# Altium project Group_2.PrjPcb
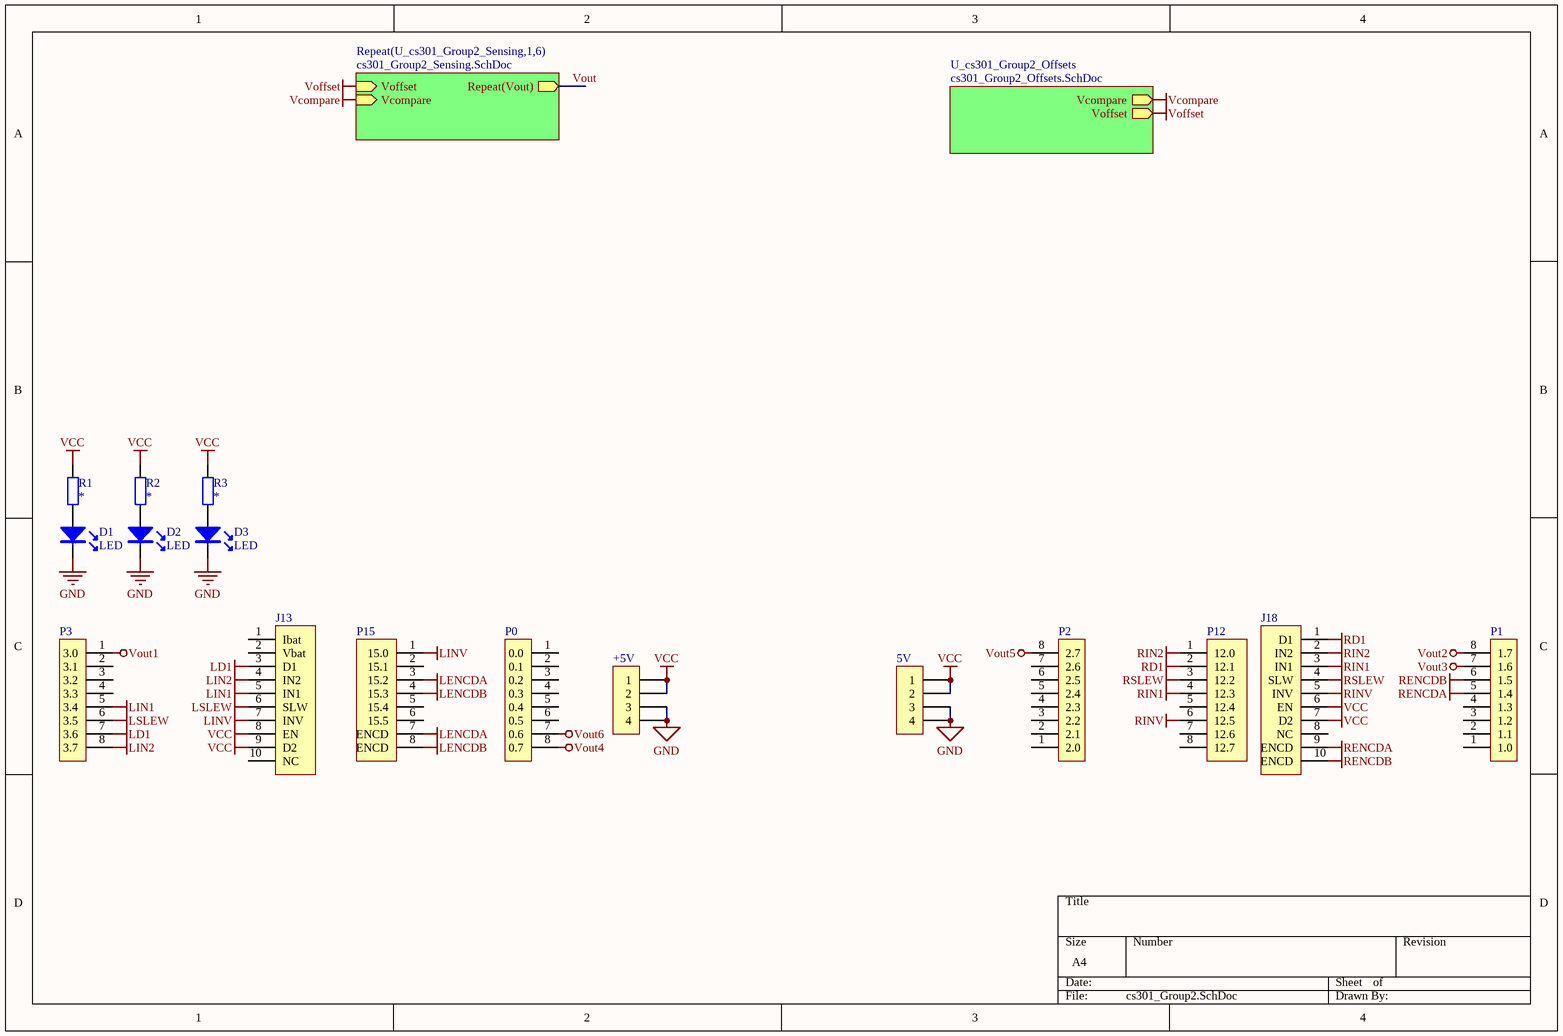
[diagram p0: cs301_Group2.SchDoc]
3 sheets, 164 parts. Net scope: hierarchical (ports join the sheet entries above them; power ports are global).
Board file: cs301_Group2_PCB.PcbDoc
Sheets:
  cs301_Group2.SchDoc
    U_cs301_Group2_Sensing1 = cs301_Group2_Sensing.SchDoc
    U_cs301_Group2_Sensing2 = cs301_Group2_Sensing.SchDoc
    U_cs301_Group2_Sensing3 = cs301_Group2_Sensing.SchDoc
    U_cs301_Group2_Sensing4 = cs301_Group2_Sensing.SchDoc
    U_cs301_Group2_Sensing5 = cs301_Group2_Sensing.SchDoc
    U_cs301_Group2_Sensing6 = cs301_Group2_Sensing.SchDoc
    U_cs301_Group2_Offsets = cs301_Group2_Offsets.SchDoc

## Sheet cs301_Group2.SchDoc
size A4; SheetNumber: 1; SheetTotal: 3

### Parts
5V  5V  [IDC4]  (value not drawn)
+5V  5V  [IDC4]  (value not drawn)
D1  LED  [LED0.1/5MM]
D2  LED  [LED0.1/5MM]
D3  LED  [LED0.1/5MM]
J13  CON10  [idc10]  (value not drawn)
J18  CON10  [IDC10]  (value not drawn)
P0  P0  [idc8]  (value not drawn)
P1  P1  [idc8]  (value not drawn)
P2  P2  [idc8]  (value not drawn)
P3  P3  [idc8]  (value not drawn)
P12  P12  [idc8]  (value not drawn)
P15  P15  [idc8]  (value not drawn)
R1  *  [0805 RES]
R2  *  [0805 RES]
R3  *  [0805 RES]

### Sub-sheets
Repeat(U_cs301_Group2_Sensing,1,6) = cs301_Group2_Sensing.SchDoc: Voffset (in), Vcompare (in), Repeat(Vout) (out)
U_cs301_Group2_Offsets = cs301_Group2_Offsets.SchDoc: Vcompare (out), Voffset (out)

### Nets
GND: 5V.3 5V.4 +5V.3 +5V.4 D1.K D2.K D3.K
LD1: J13.3(D1) P3.7(3.6)
LENCDA: P15.3(15.2) P15.7(ENCD)
LENCDB: P15.4(15.3) P15.8(ENCD)
LIN1: J13.5(IN1) P3.5(3.4)
LIN2: J13.4(IN2) P3.8(3.7)
LINV: J13.7(INV) P15.1(15.0)
LSLEW: J13.6(SLW) P3.6(3.5)
RD1: J18.1(D1) P12.2(12.1)
RENCDA: J18.9(ENCD) P1.5(1.4)
RENCDB: J18.10(ENCD) P1.6(1.5)
RIN1: J18.3(IN1) P12.4(12.3)
RIN2: J18.2(IN2) P12.1(12.0)
RINV: J18.5(INV) P12.6(12.5)
RSLEW: J18.4(SLW) P12.3(12.2)
VCC: 5V.1 5V.2 +5V.1 +5V.2 J13.8(EN) J13.9(D2) J18.6(EN) J18.7(D2) R1.2 R2.2 R3.2
Vcompare: sheet Repeat(U_cs301_Group2_Sensing,1,6)/Vcompare, sheet U_cs301_Group2_Offsets/Vcompare
Voffset: sheet Repeat(U_cs301_Group2_Sensing,1,6)/Voffset, sheet U_cs301_Group2_Offsets/Voffset
Vout1: P3.1(3.0)
Vout2: P1.8(1.7)
Vout3: P1.7(1.6)
Vout4: P0.8(0.7)
Vout5: P2.8(2.7)
Vout6: P0.7(0.6)
Vout: sheet Repeat(U_cs301_Group2_Sensing,1,6)/Repeat(Vout)
NetD1_A: D1.A R1.1
NetD2_A: D2.A R2.1
NetD3_A: D3.A R3.1

Not connected (* = marked no-connect by the designer): J13 1(Ibat) 2(Vbat) 10(NC); J18 8(NC); P0 1(0.0) 2(0.1) 3(0.2) 4(0.3) 5(0.4) 6(0.5); P1 1(1.0) 2(1.1) 3(1.2) 4(1.3); P2 1(2.0) 2(2.1) 3(2.2) 4(2.3) 5(2.4) 6(2.5) 7(2.6); P3 2(3.1) 3(3.2) 4(3.3); P12 5(12.4) 7(12.6) 8(12.7); P15 2(15.1) 5(15.4) 6(15.5)

### Library data of the parts
5V +5V = CON4: Connector
J13 J18 = CON10: Connector
P0-P3 = CON8: Connector
P12 P15 = CON8_1: Connector
R1-R3 = Res_SMT_0805: 0805 resistor; Published: 8-Jun-2000; LatestRevisionDate: 17-Jul-2002; LatestRevisionNote: Re-released for DXP Platform.; PackageReference: AXIAL-0.4; Publisher: Altium Limited; Value: *; ComponentLink1Description: https://nz.mouser.com/datasheet/2/315/AOA0000C304-1149620.pdf

## Sheet cs301_Group2_Sensing.SchDoc
size A4; SheetNumber: 2; SheetTotal: 3
Used 6 times, as channels U_cs301_Group2_Sensing1, U_cs301_Group2_Sensing2, U_cs301_Group2_Sensing3, U_cs301_Group2_Sensing4, U_cs301_Group2_Sensing5, U_cs301_Group2_Sensing6. Parts and nets are listed once, with the designators drawn on the sheet.
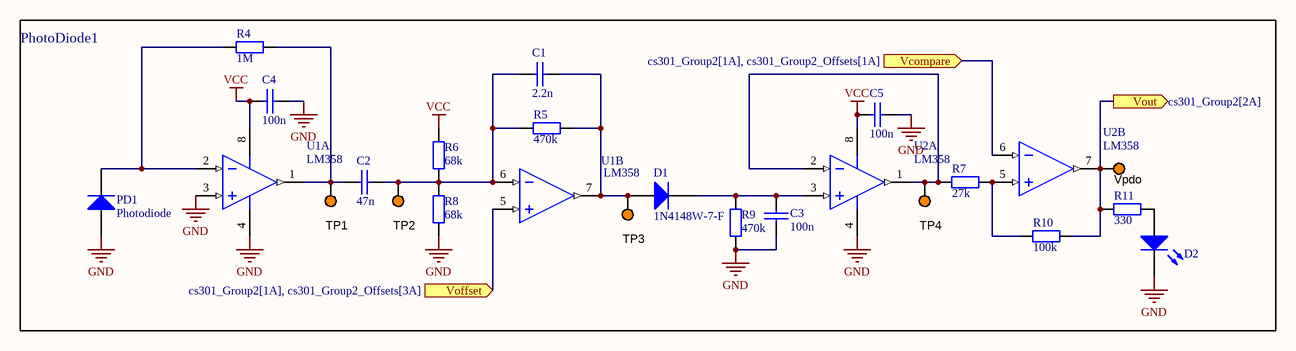
[diagram p1: cs301_Group2_Sensing.SchDoc]

### Parts
C1  2.2n  [0805 CAP]
C2  47n  [0805 CAP]
C3  100n  [0805 CAP]
C4  100n  [0805 CAP]
C5  100n  [0805 CAP]
D1  1N4148W-7-F  [SOD123]
D2  LTST-C170KGKT  [0805 LED]  (value not drawn)
PD1  Photodiode  [SOD123]
R4  1M  [0805 RES]
R5  470k  [0805 RES]
R6  68k  [0805 RES]
R7  27k  [0805 RES]
R8  68k  [0805 RES]
R9  470k  [0805 RES]
R10  100k  [0805 RES]
R11  330  [0805 RES]
TP1  5003  [TP_TH]  (value not drawn)
TP2  5003  [TP_TH]  (value not drawn)
TP3  5003  [TP_TH]  (value not drawn)
TP4  5003  [TP_TH]  (value not drawn)
U1  LM358  [SO - 8]  (parts A,B of 2)
U2  LM358  [SO - 8]  (parts A,B of 2)
Vpdo  5003  [TP_TH]  (value not drawn)

### Blocks framed on the sheet
PhotoDiode1: C1-C5 D1 D2 PD1 R4-R11 TP1-TP4 U1 U2 Vpdo

### Ports
Vcompare (in, see cs301_Group2[1A], cs301_Group2_Offsets[1A]), Voffset (in, see cs301_Group2[1A], cs301_Group2_Offsets[3A]), Vout (out, see cs301_Group2[2A])

### Nets
GND: C3.1 C4.2 C5.2 D2.2(K) PD1.1(A) R8.1 R9.1 U1.3(VINA+) U1.4(VSS) U2.4(VSS)
VCC: C4.1 C5.1 R6.2 U1.8(VDD) U2.8(VDD)
Vcompare: U2.6(VINA-) ; port Vcompare
Voffset: U1.5(VINA+) ; port Voffset
Vout: R10.1 R11.1 U2.7(VOUTA) Vpdo.1 ; port Vout
NetC1_1: C1.1 C2.2 R5.2 R6.1 R8.2 TP2.1 U1.6(VINA-)
NetC1_2: C1.2 D1.1(A) R5.1 TP3.1 U1.7(VOUTA)
NetC2_1: C2.1 R4.1 TP1.1 U1.1(VOUTA)
NetC3_2: C3.2 D1.2(K) R9.2 U2.3(VINA+)
NetD2_1: D2.1(A) R11.2
NetPD1_2: PD1.2(K) R4.2 U1.2(VINA-)
NetR7_1: R7.1 R10.2 U2.5(VINA+)
NetR7_2: R7.2 TP4.1 U2.1(VOUTA) U2.2(VINA-)

### Channels
U_cs301_Group2_Sensing1: designators end in A; ports Vcompare=Vcompare Voffset=Voffset Vout=Vout1
U_cs301_Group2_Sensing2: designators end in B; ports Vcompare=Vcompare Voffset=Voffset Vout=Vout2
U_cs301_Group2_Sensing3: designators end in C; ports Vcompare=Vcompare Voffset=Voffset Vout=Vout3
U_cs301_Group2_Sensing4: designators end in D; ports Vcompare=Vcompare Voffset=Voffset Vout=Vout4
U_cs301_Group2_Sensing5: designators end in E; ports Vcompare=Vcompare Voffset=Voffset Vout=Vout5
U_cs301_Group2_Sensing6: designators end in F; ports Vcompare=Vcompare Voffset=Voffset Vout=Vout6

### Library data of the parts
C1-C5 = CerCap_SMT_0805: SMT ceramic capacitor 0805 size; Value: *
D1 = ES1H_SMT_DO214: 1N4148 100V 200mA SOD-123 diode; Manufacturer: ON Semiconductor; Manufacturer Part Number: 1N4148TR; Diode Type: Standard; Speed: Small Signal =< 200mA (Io), Any Speed; Capacitance @ Vr, F: 4pF @ 0V, 1MHz; Supplier 1: Digi-Key; RoHS: RoHS Compliant; Category: Discrete Semiconductor Products; Stock 1: 1658049; Pricing 1: 1=0.16, 10=0.109, 100=0.0592, 500=0.03648, 1000=0.02488 (NZD); Part Status: Active; Current - Average Rectified (Io): 200mA; Mounting Type: Through Hole; Package / Case: DO-204AH, DO-35, Axial; Supplier Device Package: DO-35; Operating Temperature - Junction: -65°C ~ 175°C; Base Part Number: 1N4148; ComponentLink1URL: https://www.fairchildsemi.com/datasheets/1N/1N914.pdf; ComponentLink1Description: https://www.fairchildsemi.com/datasheets/1N/1N914.pdf; Supplier Part Number 1: 1N4148FSCT-ND
D2 = LED_SMT_0805: SMT LED 0805 size; Manufacturer: Lite-On Inc.; Color: Green; Lens Color: Colorless; Lens Transparency: Clear; Millicandela Rating: 35mcd; Lens Style/Size: Rectangle with Flat Top, 1.40mm x 1.25mm; Voltage - Forward (Vf) (Typ): 2V; Current - Test: 20mA; Viewing Angle: 130°; Wavelength - Dominant: 571nm; Wavelength - Peak: 574nm; Supplier 1: Digi-Key; Manufacturer Part Number: LTST-C170KGKT; RoHS: RoHS Compliant; Category: Optoelectronics; Stock 1: 503069; Pricing 1: 1=0.62, 10=0.459, 25=0.338, 100=0.2415, 250=0.16416, 500=0.14486, 1000=0.11347 (NZD); Packaging: Cut Tape (CT); Part Status: Active; Mounting Type: Surface Mount; Features: -; Package / Case: 0805 (2012 Metric); Size / Dimension: 2.00mm L x 1.25mm W; Height (Max): 1.10mm; ComponentLink1URL: http://optoelectronics.liteon.com/upload/download/DS22-2000-073/LTST-C170KGKT.pdf; ComponentLink1Description: http://optoelectronics.liteon.com/upload/download/DS22-2000-073/LTST-C170KGKT.pdf; Supplier Part Number 1: 160-1414-1-ND
PD1 = 1N4148_SMT_SOD123: DIODE GEN PURP 100V 300MA SOD123; Manufacturer: Diodes Incorporated; Manufacturer Part Number: 1N4148W-13-F; Diode Type: Standard; Current - Average Rectified (Io): 150mA; Speed: Small Signal =< 200mA (Io), Any Speed; Capacitance @ Vr, F: 2pF @ 0V, 1MHz; Supplier 1: Digi-Key; RoHS: RoHS Compliant; Category: Discrete Semiconductor Products; Stock 1: 5282; Pricing 1: 1=0.33, 10=0.292, 100=0.1586, 500=0.0976, 1000=0.06656 (NZD); Packaging: Cut Tape (CT); Part Status: Active; Mounting Type: Surface Mount; Package / Case: SOD-123; Supplier Device Package: SOD-123; Operating Temperature - Junction: -65°C ~ 150°C; Base Part Number: 1N4148W; ComponentLink1URL: https://www.diodes.com/assets/Datasheets/ds30086.pdf; ComponentLink1Description: https://www.diodes.com/assets/Datasheets/ds30086.pdf; Supplier Part Number 1: 1N4148W-13FDICT-ND
R4-R11 = Res_SMT_0805: 0805 resistor; Published: 8-Jun-2000; LatestRevisionDate: 17-Jul-2002; LatestRevisionNote: Re-released for DXP Platform.; PackageReference: AXIAL-0.4; Publisher: Altium Limited; Value: *; ComponentLink1Description: https://nz.mouser.com/datasheet/2/315/AOA0000C304-1149620.pdf
TP1-TP4 Vpdo = TestPoint: Test Point, Orange, 1-Pin THD, RoHS; Peak Reverse Current: 600 uA; Forward Current: 3 A; Max Surge Current: 80 A; Forward Voltage: 1.08 V; Max Operating Temperature: 150 degC; PackageReference: 5003; Pins: 2; ComponentLink2URL: http://keyelco.com/userAssets/file/M65p56.pdf; PackageDescription: 1-Pin Through Hole Device, Dia 2.54 mm; Weight: 0.01 lb; Diameter: 5.3 mm; Mount: Through Hole; Package Quantity: 500; Packaging: Bulk; Min Operating Temperature: -65 degC; ComponentLink1Description: Manufacturer URL; Height: 0.25 inch; ComponentLink1URL: http://www.keyelco.com/; ComponentLink2Description: Datasheet; Width: 0.25 inch; REACH SVHC: No SVHC; RoHSCompliant: true; Radiation Hardening: No; Length: 9.5 mm; DatasheetVersion: Jun-15
U1 U2 = LM358_SMT_SOIC8: IC OPAMP 8SOIC; ComponentLink1URL: http://www.ti.com/lit/ds/symlink/tlc080a.pdf; ComponentLink1Description: http://www.ti.com/lit/ds/symlink/tlc080a.pdf; Supplier 1: Digi-Key; Supplier Part Number 1: 296-1014-1-ND

## Sheet cs301_Group2_Offsets.SchDoc
size A4; SheetNumber: 3; SheetTotal: 3
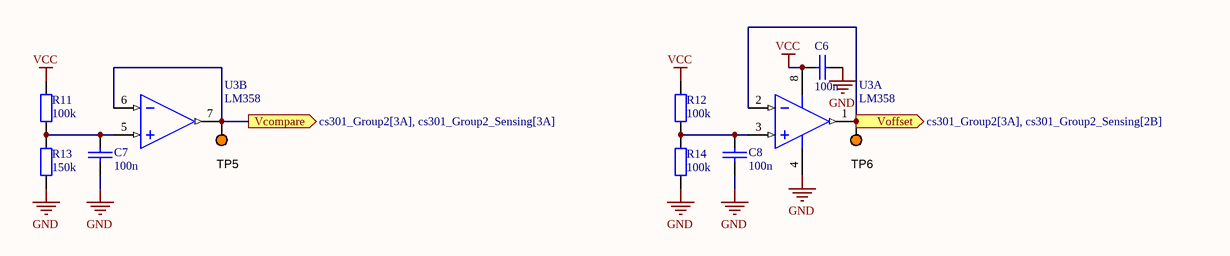
[diagram p2: cs301_Group2_Offsets.SchDoc]

### Parts
C6  100n  [0805 CAP]
C7  100n  [0805 CAP]
C8  100n  [0805 CAP]
R11  100k  [0805 RES]
R12  100k  [0805 RES]
R13  150k  [0805 RES]
R14  100k  [0805 RES]
TP5  5003  [TP_TH]  (value not drawn)
TP6  5003  [TP_TH]  (value not drawn)
U3  LM358  [SO - 8]  (parts A,B of 2)

### Ports
Vcompare (out, see cs301_Group2[3A], cs301_Group2_Sensing[3A]), Voffset (out, see cs301_Group2[3A], cs301_Group2_Sensing[2B])

### Nets
GND: C6.2 C7.1 C8.1 R13.2 R14.2 U3.4(VSS)
VCC: C6.1 R11.1 R12.1 U3.8(VDD)
Vcompare: TP5.1 U3.6(VINA-) U3.7(VOUTA) ; port Vcompare
Voffset: TP6.1 U3.1(VOUTA) U3.2(VINA-) ; port Voffset
NetC7_2: C7.2 R11.2 R13.1 U3.5(VINA+)
NetC8_2: C8.2 R12.2 R14.1 U3.3(VINA+)

### Library data of the parts
C6-C8 = CerCap_SMT_0805: SMT ceramic capacitor 0805 size; Value: *
R11-R14 = Res_SMT_0805: 0805 resistor; Published: 8-Jun-2000; LatestRevisionDate: 17-Jul-2002; LatestRevisionNote: Re-released for DXP Platform.; PackageReference: AXIAL-0.4; Publisher: Altium Limited; Value: *; ComponentLink1Description: https://nz.mouser.com/datasheet/2/315/AOA0000C304-1149620.pdf
TP5 TP6 = TestPoint: as TP1 on sheet cs301_Group2_Sensing; Max Operating Temperature: 150 degC; PackageReference: 5003; Pins: 2; ComponentLink2URL: http://keyelco.com/userAssets/file/M65p56.pdf; PackageDescription: 1-Pin Through Hole Device, Dia 2.54 mm; Weight: 0.01 lb; Diameter: 5.3 mm; Mount: Through Hole; Package Quantity: 500; Packaging: Bulk; Min Operating Temperature: -65 degC; ComponentLink1Description: Manufacturer URL; Height: 0.25 inch; ComponentLink1URL: http://www.keyelco.com/; ComponentLink2Description: Datasheet; Width: 0.25 inch; REACH SVHC: No SVHC; RoHSCompliant: true; Radiation Hardening: No; Length: 9.5 mm; DatasheetVersion: Jun-15
U3 = LM358_SMT_SOIC8: IC OPAMP 8SOIC; ComponentLink1URL: http://www.ti.com/lit/ds/symlink/tlc080a.pdf; ComponentLink1Description: http://www.ti.com/lit/ds/symlink/tlc080a.pdf; Supplier 1: Digi-Key; Supplier Part Number 1: 296-1014-1-ND

## Nets that join several sheets
GND: cs301_Group2 (7 pins), U_cs301_Group2_Sensing1 (10 pins), U_cs301_Group2_Sensing2 (10 pins), U_cs301_Group2_Sensing3 (10 pins), U_cs301_Group2_Sensing4 (10 pins), U_cs301_Group2_Sensing5 (10 pins), U_cs301_Group2_Sensing6 (10 pins), cs301_Group2_Offsets (6 pins)
VCC: cs301_Group2 (11 pins), U_cs301_Group2_Sensing1 (5 pins), U_cs301_Group2_Sensing2 (5 pins), U_cs301_Group2_Sensing3 (5 pins), U_cs301_Group2_Sensing4 (5 pins), U_cs301_Group2_Sensing5 (5 pins), U_cs301_Group2_Sensing6 (5 pins), cs301_Group2_Offsets (C6.1 R11.1 R12.1 U3.8)
Vcompare: U_cs301_Group2_Sensing1 (U2A.6), U_cs301_Group2_Sensing2 (U2B.6), U_cs301_Group2_Sensing3 (U2C.6), U_cs301_Group2_Sensing4 (U2D.6), U_cs301_Group2_Sensing5 (U2E.6), U_cs301_Group2_Sensing6 (U2F.6), cs301_Group2_Offsets (TP5.1 U3.6 U3.7)
Voffset: U_cs301_Group2_Sensing1 (U1A.5), U_cs301_Group2_Sensing2 (U1B.5), U_cs301_Group2_Sensing3 (U1C.5), U_cs301_Group2_Sensing4 (U1D.5), U_cs301_Group2_Sensing5 (U1E.5), U_cs301_Group2_Sensing6 (U1F.5), cs301_Group2_Offsets (TP6.1 U3.1 U3.2)
Vout1: cs301_Group2 (P3.1), U_cs301_Group2_Sensing1 (R10A.1 R11A.1 U2A.7 VpdoA.1)
Vout2: cs301_Group2 (P1.8), U_cs301_Group2_Sensing2 (R10B.1 R11B.1 U2B.7 VpdoB.1)
Vout3: cs301_Group2 (P1.7), U_cs301_Group2_Sensing3 (R10C.1 R11C.1 U2C.7 VpdoC.1)
Vout4: cs301_Group2 (P0.8), U_cs301_Group2_Sensing4 (R10D.1 R11D.1 U2D.7 VpdoD.1)
Vout5: cs301_Group2 (P2.8), U_cs301_Group2_Sensing5 (R10E.1 R11E.1 U2E.7 VpdoE.1)
Vout6: cs301_Group2 (P0.7), U_cs301_Group2_Sensing6 (R10F.1 R11F.1 U2F.7 VpdoF.1)